# EAGLE design dip_version (EAGLE 5.00)
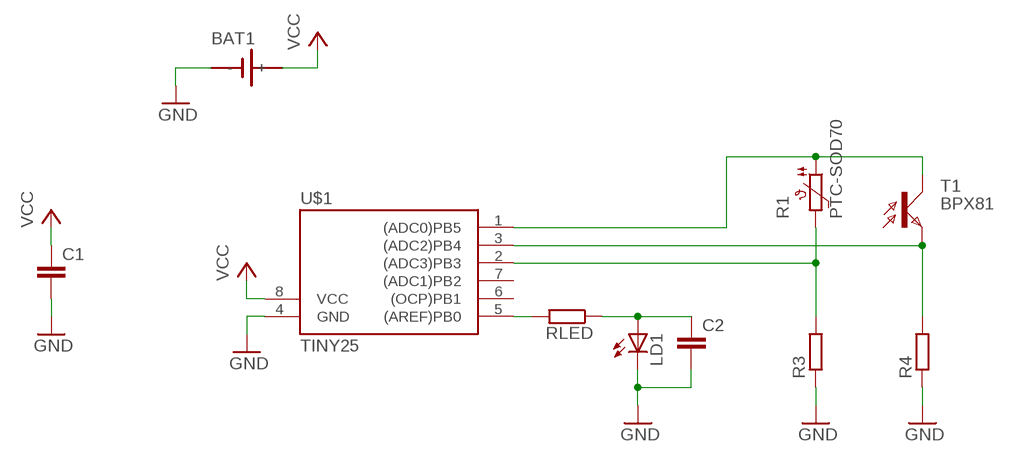
[diagram p0: schematic, sheet 1]

## Parts
BAT1  SN2032  [SN2032]
C1  C-EU025-024X044  [C025-024X044]
C2  C-EU025-024X044  [C025-024X044]
LD1  LED3MM  [LED3MM]
R1  PTC-SOD70  [SOD70]
R3  R-EU_0204/5  [0204/5]
R4  R-EU_0204/5  [0204/5]
RLED  R-EU_0204/5  [0204/5]
T1  BPX81  [BPX81]
U$1  TINY25  [DIL08]

## Nets
GND: BAT1.- C1.2 C2.2 LD1.K(C) R3.1 R4.1 U$1.4(GND)
N$1: RLED.2 U$1.5((AREF)PB0)
N$2: C2.1 LD1.A RLED.1
N$3: R1.1 T1.C U$1.1((ADC0)PB5)
N$4: R1.2 R3.2 U$1.2((ADC3)PB3)
N$5: R4.2 T1.E U$1.3((ADC2)PB4)
VCC: BAT1.+ C1.1 U$1.8(VCC)
Unconnected: U$1.6((OCP)PB1) U$1.7((ADC1)PB2)

## Library data of the parts
BAT1 = sn2032:SN2032: LI BATTERY
C1 C2 = rcl:C-EU: CAPACITOR, European symbol
LD1 = led:LED: LED OSRAM: - CHIPLED LG R971, LG N971, LY N971, LG Q971, LY Q971, LO R971, LY R971 LH N974, LH R974 LS Q976, LO Q976, LY Q976 LO Q996 - Hyper CHIPLED LW Q18S LB Q993, LB Q99A, LB R99A - SideLED LS A670, LO A670, LY A670, LG A670, LP A670 LB A673, LV A673, LT A673, LW A673 LH A674 LY A675 LS A676, LA A676, LO A676, LY A676, LW A676 LS A679, LY A679, LG A679 - Hyper Micro SIDELED® LS Y876, LA Y876, LO Y876, LY Y876 LT Y87S - SmartLED LW L88C, LW L88S LB L89C, LB L89S, LG L890 LS L89K, LO L89K, LY L89K LS L896, LA L896, LO L896, LY L896 - TOPLED LS T670, LO T670, LY T670, LG T670, LP T670 LSG T670, LSP T670, LSY T670, LOP T670, LYG T670 LG T671, LOG T671, LSG T671 LB T673, LV T673, LT T673, LW T673 LH T674 LS T676, LA T676, LO T676, LY T676, LB T676, LH T676, LSB T676, LW T676 LB T67C, LV T67C, LT T67C, LS T67K, LO T67K, LY T67K, LW E67C LS E67B, LA E67B, LO E67B, LY E67B, LB E67C, LV E67C, LT E67C LW T67C LS T679, LY T679, LG T679 LS T770, LO T770, LY T770, LG T770, LP T770 LB T773, LV T773, LT T773, LW T773 LH T774 LS E675, LA E675, LY E675, LS T675 LS T776, LA T776, LO T776, LY T776, LB T776 LHGB T686 LT T68C, LB T68C - Hyper Mini TOPLED® LB M676 - Mini TOPLED Santana® LG M470 LS M47K, LO M47K, LY M47K Source: http://www.osram.convergy.de/
R1 = ptc-ntc:PTC-: Positive Temperature Coefficient Resistor (PTC) termistor Philips KTY81-210 - KTY81-252 Source: 153627-da-01-en-Temperatur-Sensor_KTY10-6_Philips.pdf
R3 R4 RLED = rcl:R-EU_: RESISTOR, European symbol
T1 = opto-trans-siemens:BPX81: PHOTO TRANSISTOR
U$1 = avr-2:TINY25

## Board
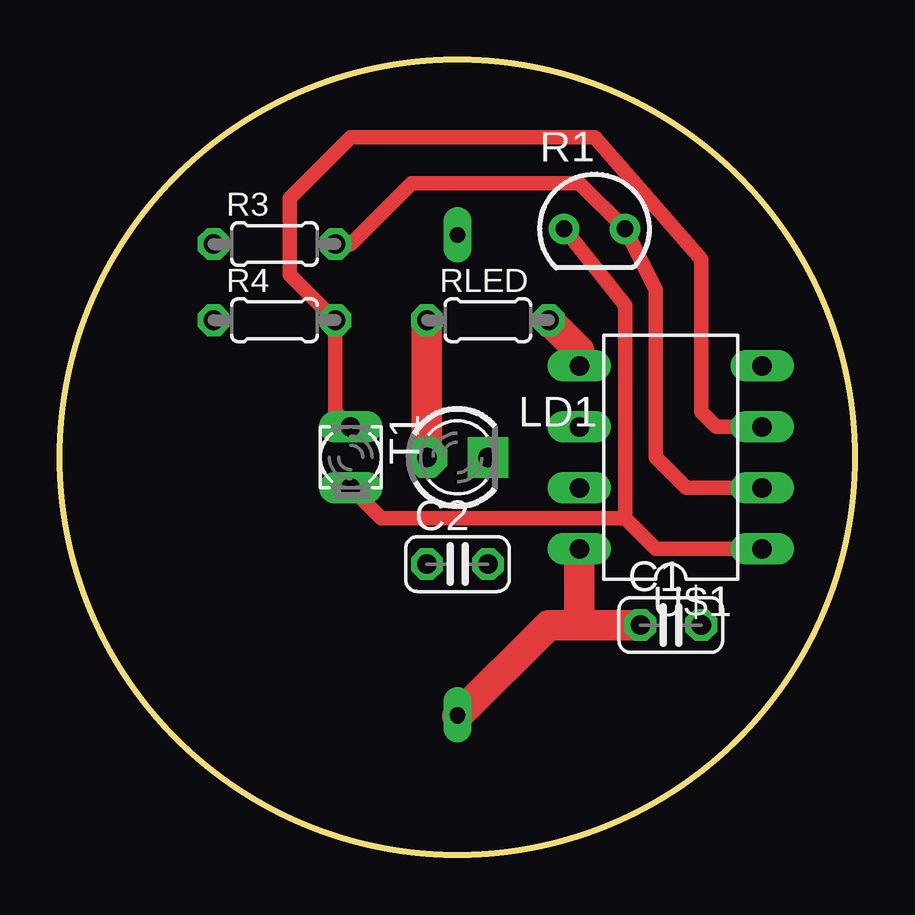
[diagram p1: board, top side]
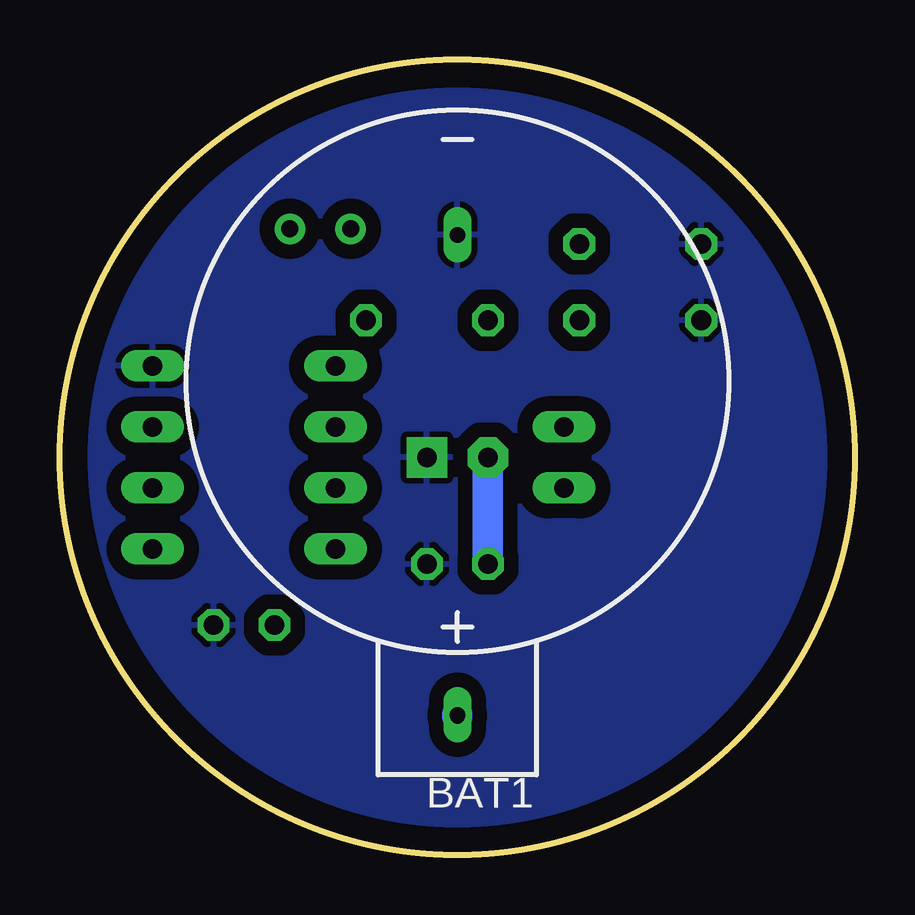
[diagram p2: board, bottom side, seen from below]

Size 33.12 x 33.12 mm. Coordinates in mm from the lower left corner, seen from the top.
Outline: circle at 16.56,16.56 radius 16.56
Copper layers (1*16): Top 0.035mm / dielectric 1.5mm / Bottom 0.035mm
Design rules "default": minimum track width 10mil, minimum drill 24mil, track to track 8mil, track to pad 8mil, pad to pad 8mil, via to via 8mil, smd to smd 8mil, copper to edge 40mil, drill to drill 8mil, minimum pad ring 10mil, minimum via ring 8mil, stop-mask expansion 4mil, vias tented up to drill 0mil, thermal gap 10mil

### Footprints (pad centres in the part's own frame; a part is rotated, then mirrored left to right if it is on the bottom)
SN2032 = drill 0.65 long: + 0,13.9; - 0,-6.1
C025-024X044 = drill 0.813 octagon: 1 -1.27,0; 2 1.27,0
LED3MM = drill 0.813 pad 1.676 octagon: A -1.27,0 | drill 0.813 pad 1.676 square: K 1.27,0
SOD70 = drill 0.7 pad 1.27 round: 1 -1.27,0; 2 1.27,0
0204/5 = drill 0.813 octagon: 1 -2.54,0; 2 2.54,0
BPX81 = drill 0.813 long: C 1.27,0; E -1.27,0
DIL08 = drill 0.813 long: 1 -3.81,-3.81; 2 -1.27,-3.81; 3 1.27,-3.81; 4 3.81,-3.81; 5 3.81,3.81; 6 1.27,3.81; 7 -1.27,3.81; 8 -3.81,3.81

### Placement (x,y rotation side)
BAT1  16.56,19.73 180 bottom
C1  25.45,9.57 0 top
C2  16.56,12.11 0 top
LD1  16.56,16.56 0 top
R1  22.27,26.08 0 top
R3  8.94,25.45 0 top
R4  8.94,22.27 0 top
RLED  17.83,22.27 0 top
T1  12.11,16.56 270 top
U$1  25.45,16.56 90 top

### Tracks (layer width: path | path; a pad name or v marks a point on that pad's centre or on a via)
GND
  pour Bottom (isolate 0.61): -3.13,33.7 34.97,33.7 34.97,-0.59 -3.13,-0.59
N$1
  Top 1.27: U$1.5 21.64,21 RLED.2
N$2
  Top 1.27: LD1.A RLED.1
  Bottom 1.27: C2.1 LD1.A
N$3
  Top 0.61: U$1.1 24.81,12.75 23.54,14.02 | 23.54,14.02 13.38,14.02 T1.C | R1.1 23.54,22.91 23.54,14.02
N$4
  Top 0.61: U$1.2 26.08,15.29 24.81,16.56 24.81,23.54 R1.2 21.64,27.99 14.65,27.99 12.11,25.45 R3.2
N$5
  Top 0.61: T1.E 11.48,18.46 R4.2 9.57,24.18 9.57,27.35 12.11,29.89 22.27,29.89 26.72,24.81 26.72,18.46 27.35,17.83 U$1.3
VCC  (via drill 0.6)
  Top 1.27: 21.64,9.57 U$1.8 | 21.64,9.57 20.37,9.57 v16.56,5.76 | 21.64,9.57 C1.1
  Bottom 1.27: BAT1.+ v16.56,5.76